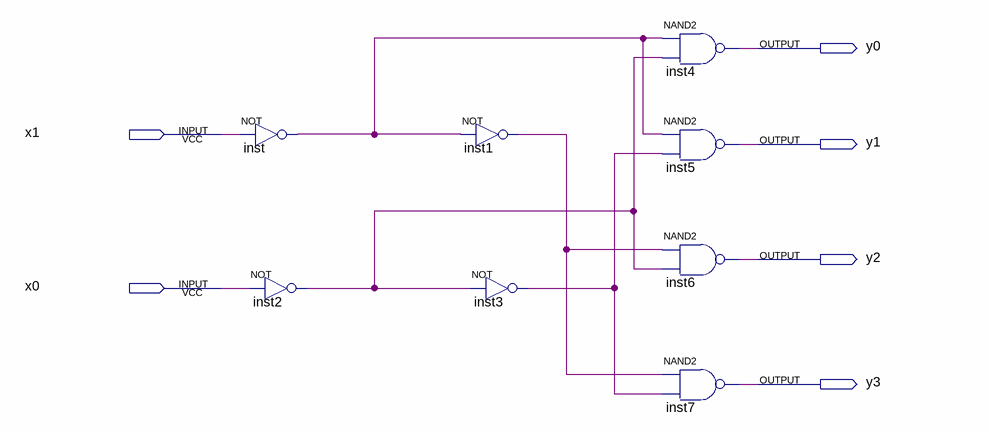
[diagram p0: schematic sheet]
// Quartus schematic 1.bdf as structural Verilog: 8 symbols, 6 pins
module \1  (
  input  x1,
  input  x0,
  output y0,
  output y1,
  output y2,
  output y3
);

  wire inst1_out, inst2_out, inst3_out, inst_out;

  not inst (inst_out, x1);
  not inst2 (inst2_out, x0);
  not inst1 (inst1_out, inst_out);
  not inst3 (inst3_out, inst2_out);
  nand inst4 (y0, inst_out, inst2_out);
  nand inst5 (y1, inst_out, inst3_out);
  nand inst6 (y2, inst1_out, inst2_out);
  nand inst7 (y3, inst1_out, inst3_out);
endmodule
